# EAGLE design Enclosure 85x58 BHWSL (EAGLE 9.6.2)
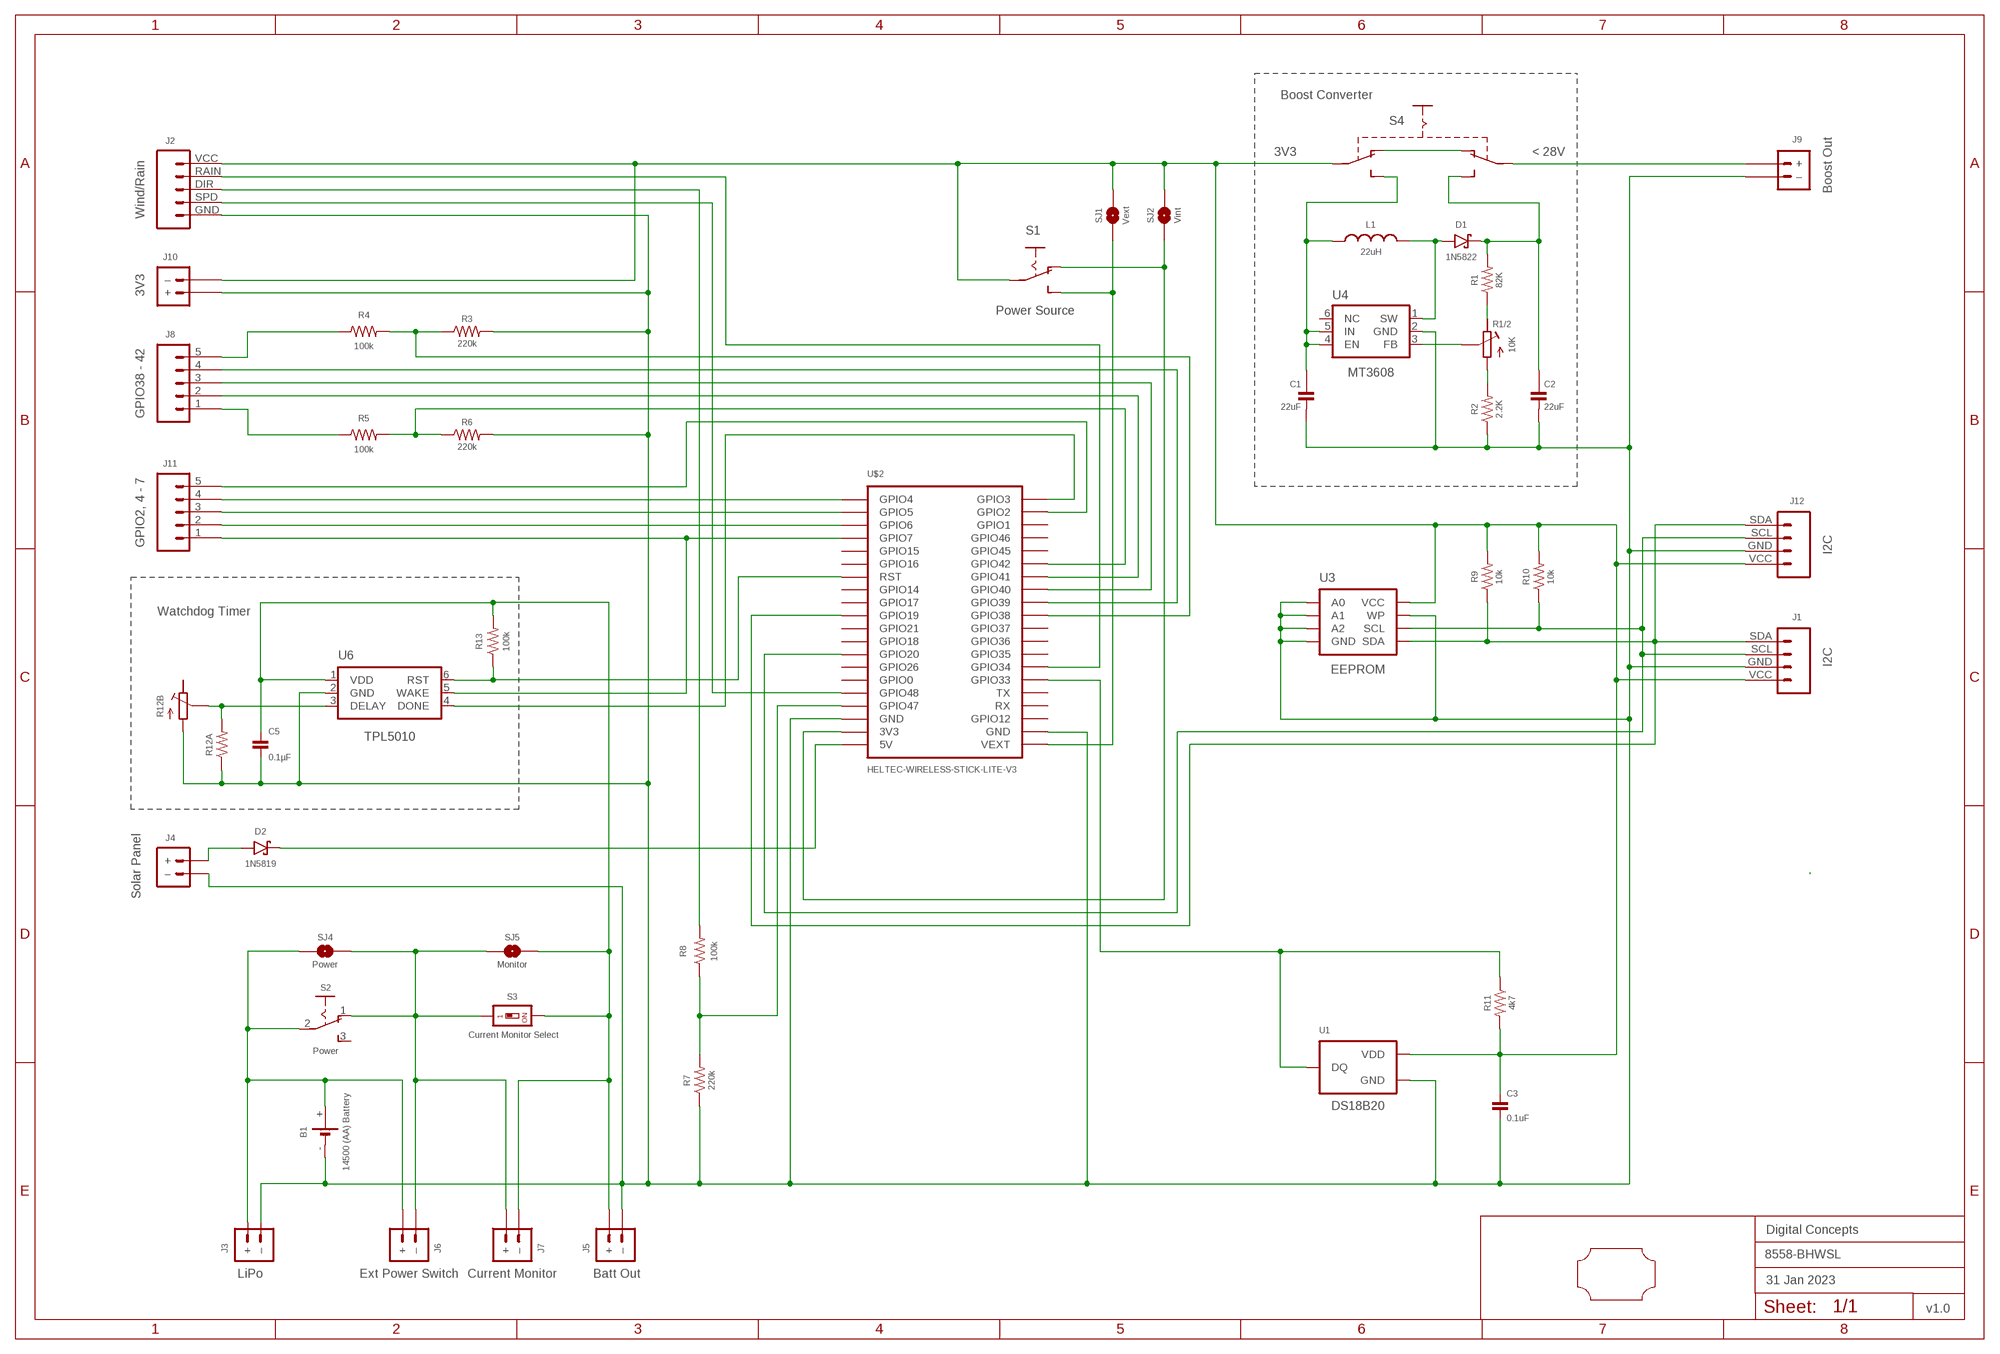
[diagram p0: schematic, sheet 1]
FRAME2 (A3L-LOC): DATE: 31 Jan 2023; OWNER: Digital Concepts; TITLE: 8558-BHWSL; VERSION: v1.0

## Parts
B1  14500 (AA) Battery  BATTERY-HOLDER-14500(AA)  [BATTERY-14500]
C1  22uF  CAPACITOR-1206  [C1206]
C2  22uF  CAPACITOR-1206  [C1206]
C3  0.1uF  CAPACITOR-0805  [C0805]
C5  0.1µF  CAPACITOR-0805  [C0805]
D1  1N5822  DIODE-SCHOTTKY-1N5822  [DIODE_SMB]
D2  1N5819  1N5819-SOD-123  [SOD-123]
J1  I2C  JST-PH2.0-4-VERTICAL-I2C  [JST-PH2.0-4-VERTICAL-I2C]
J2  Wind/Rain  JST-PH2.0-5-VERTICAL-WEATHER  [JST-PH2.0-5-WEATHER]
J3  LiPo  JST-PH2.0-2-MALE-HORIZONTALJST-PTH-2  [JST-PH2.0-2-HORIZONTAL]
J4  Solar Panel  JST-PH2.0-2-DUAL-POWERJST-PTH-2  [JST-PH2.0-2-DUAL-POWER]
J5  Batt Out  JST-GH1.25-2-HORIZONTAL-POWER  [JST-GH1.25-2-HORIZONTAL]
J6  Ext Power Switch  JST-PH2.0-2-DUAL-POWERJST-PTH-2  [JST-PH2.0-2-DUAL-POWER]
J7  Current Monitor  JST-PH2.0-2-HORIZONTAL-POWERJST-PTH-2  [JST-PH2.0-2-HORIZONTAL-POWER@1]
J8  GPIO38 - 42  JST-PH2.0-5-HORIZONTAL  [JST-PH2.0-5-HORIZONTAL]
J9  Boost Out  JST-PH2.0-2-H-POWER  [JST-PH2.0-2-HORIZONTAL-POWER]
J10  3V3  JST-PH2.0-2-H-POWER  [JST-PH2.0-2-HORIZONTAL-POWER]
J11  GPIO2, 4 - 7  JST-PH2.0-5-HORIZONTAL  [JST-PH2.0-5-HORIZONTAL]
J12  I2C  JST-PH2.0-4-HORIZONTAL-I2C  [JST-PH2.0-4-HORIZONTAL-I2C]
L1  22uH  INDUCTOR-CDRH104R/6D28L5038P  [CDRH104R+6D28]
R1  82K  RESISTORR0805  [R0805]
R1/2  10K  RESISTOR-TRIMM-BAOTER-HORIZONTAL  [RTRIM64P]
R2  2.2K  RESISTORR0805  [R0805]
R3  220k  RESISTORR0805  [R0805]
R4  100k  RESISTORR0805  [R0805]
R5  100k  RESISTORR0805  [R0805]
R6  220k  RESISTORR0805  [R0805]
R7  220k  RESISTORR0805  [R0805]
R8  100k  RESISTORR0805  [R0805]
R9  10k  RESISTORR0805  [R0805]
R10  10k  RESISTORR0805  [R0805]
R11  4k7  RESISTORR0805  [R0805]
R12A  RESISTORR0805  [R0805]
R12B  RESISTOR-TRIMM-33  [RTRIM3*3]
R13  100k  RESISTORR0805  [R0805]
S1  Power Source  SWITCH-SLIDE-SPDT-SMT  [SWITCH-SPDT-SMT]
S2  Power  SWITCH-SLIDE-SPDT  [SWITCH-SLIDE-SPDT]
S3  Current Monitor Select  SWITCH-DIP-SWS001  [SMD-001]
S4  SWITCH-SLIDE-DPDT-PTH-S  [SWITCH-DPDT-PTH]
SJ1  Vext  SJ  [SJ]
SJ2  Vint  SJ-V-1  [SJ-VIA-1]
SJ4  Power  SJ  [SJ]
SJ5  Monitor  SJ  [SJ]
U1  DS18B20  THERMOMETER-DS18B20  [TO-92]
U3  EEPROM  AT24CXX-EEPROM  [SOP-8]
U4  MT3608  [SOT-23-6@1]
U6  TPL5010  TPL5010DDCR  [SOT-23-6]
U$1  PCB-OUTLINE-85X58  [PROTO-28X18-OUTLINE]
U$2  HELTEC-WIRELESS-STICK-LITE-V3  [HELTEC-WIRELESS-STICK-LITE-V3]

## Nets
GND: B1.- C1.2 C2.2 C3.2 C5.2 J1.GND J2.GND J3.-(–) J4.-(–) J5.-(–) J9.-(–) J10.+ J12.GND R2.1 R3.2 R6.2 R7.1 R12A.1 R12B.1(A) U1.1(GND) U3.P$1(A0) U3.P$2(A1) U3.P$3(A2) U3.P$4(GND) U3.P$7(WP) U4.2(GND) U6.2(GND) U$2.GND@18(GND) U$2.GND@22(GND)
N$1: D2.A J4.+
N$2: J2.DIR R8.2
N$3: R1.1 R1/2.3(E)
N$4: B1.+ J3.+ J6.+ S2.2(P) SJ4.2
N$5: D2.C U$2.5V
N$6: D1.A L1.1 U4.1(SW)
N$7: R7.2 R8.1 U$2.GPIO47
N$8: J1.SCL J12.SCL R10.1 U3.P$6(SCL) U$2.GPIO20
N$9: J8.1 R5.1
N$10: J11.5 U$2.GPIO2
N$11: J1.SDA J12.SDA R9.1 U3.P$5(SDA) U$2.GPIO19
N$12: J2.SPD U$2.GPIO48
N$13: S1.P$1(O) SJ2.2 U$2.3V3
N$14: C5.1 J5.+ J7.-(–) R13.2 S3.2 SJ5.1 U6.1(VDD)
N$15: J11.4 U$2.GPIO4
N$16: J11.3 U$2.GPIO5
N$18: R11.1 U1.2(DQ) U$2.GPIO33
N$19: J11.2 U$2.GPIO6
N$20: C2.1 D1.C R1.2 S4.P$3(S1)
N$21: S1.P$2(S) SJ1.2 U$2.VEXT
N$22: J2.RAIN U$2.GPIO34
N$23: R1/2.1(A) R2.2
N$24: R1/2.2(S) U4.3(FB)
N$25: C1.1 L1.2 S4.P$6(S2) U4.4(EN) U4.5(IN)
N$26: S4.P$1(O1) S4.P$4(O2)
N$27: J9.+ S4.P$2(P1)
N$28: J11.1 U6.5(WAKE) U$2.GPIO7
N$29: J8.2 U$2.GPIO41
N$30: J8.3 U$2.GPIO40
N$31: J8.4 U$2.GPIO39
N$32: J8.5 R4.1
N$33: R3.1 R4.2 U$2.GPIO38
N$34: R5.2 R6.1 U$2.GPIO42
N$36: R12A.2 R12B.2(S) U6.3(DELAY)
N$37: R13.1 U6.6(RST) U$2.RST
N$38: U6.4(DONE) U$2.GPIO3
N$39: J6.-(–) J7.+ S2.1(O) S3.1 SJ4.1 SJ5.2
VCC: C3.1 J1.VCC J2.VCC J10.-(–) J12.VCC R9.2 R10.2 R11.2 S1.COMMON(P) S4.P$5(P2) SJ1.1 SJ2.1 SJ2.1@V U1.3(VDD) U3.P$8(VCC)
Unconnected: R12B.3(E) S2.3(S) U4.6(NC) U$2.GPIO0 U$2.GPIO1 U$2.GPIO12 U$2.GPIO14 U$2.GPIO15 U$2.GPIO16 U$2.GPIO17 U$2.GPIO18 U$2.GPIO21 U$2.GPIO26 U$2.GPIO35 U$2.GPIO36 U$2.GPIO37 U$2.GPIO45 U$2.GPIO46 U$2.RX U$2.TX

## Notes on the sheet
- Boost Converter
- 3V3 | < 28V
- Watchdog Timer

## Library data of the parts
B1 = digitalconcepts:BATTERY-HOLDER-14500(AA): 14500 (AA) battery holder
C1 C2 = digitalconcepts:CAPACITOR-1206: 1206 Capacitor
C3 C5 = digitalconcepts:CAPACITOR-0805: 0805 Capacitor
D1 = digitalconcepts:DIODE-SCHOTTKY-1N5822: 1N5822 Schottky Diode SMB
D2 = digitalconcepts:1N5819-SOD-123: 1N5819 Schottky Diode SOD-123
J1 = digitalconcepts:JST-PH2.0-4-VERTICAL-I2C: PH2.0 4P I2C Vertical Connector
J2 = digitalconcepts:JST-PH2.0-5-VERTICAL-WEATHER: PH2.0 5P Vertical Weather Connector
J3 = digitalconcepts:JST-PH2.0-2-MALE-HORIZONTAL: PH2.0 2P Right Angle PCB Connector; PROD_ID: CONN-09863; SKU: PRT-09914
J4 J6 = digitalconcepts:JST-PH2.0-2-DUAL-POWER: JST PH2.0 2P PTH Dual-Side Connector (Power); PROD_ID: CONN-09863; SKU: PRT-09914
J5 = digitalconcepts:JST-GH1.25-2-HORIZONTAL-POWER: JST GH1.25 2P PTH Connector (Power)
J7 = digitalconcepts:JST-PH2.0-2-HORIZONTAL-POWER: PH2.0 2P Right Angle PCB Connector; PROD_ID: CONN-09863; SKU: PRT-09914
J8 J11 = digitalconcepts:JST-PH2.0-5-HORIZONTAL: PH2.0 5P Horizontal Connector
J9 J10 = digitalconcepts:JST-PH2.0-2-H-POWER: JST PH2.0 2P Right Angle Connector with power pin labelling
J12 = digitalconcepts:JST-PH2.0-4-HORIZONTAL-I2C: PH2.0 4P I2C Horizontal Connector
L1 = digitalconcepts:INDUCTOR-CDRH104R/6D28: Inductor; SPICEPREFIX: L
R1-R11 R12A R13 = digitalconcepts:RESISTOR: Resistor; SPICEPREFIX: R
R1/2 = digitalconcepts:RESISTOR-TRIMM-BAOTER-HORIZONTAL: Trimm Resistor - Horizontal BAOTER
R12B = digitalconcepts:RESISTOR-TRIMM-3*3: Trimm Resistor - 3*3 SMD
S1 = digitalconcepts:SWITCH-SLIDE-SPDT-SMT: Mini Sliding Switch SPDT SMT
S2 = digitalconcepts:SWITCH-SLIDE-SPDT: Mini Sliding Switch SPDT
S3 = digitalconcepts:SWITCH-DIP-SWS001: SMD Dip Switch 1 pol.
S4 = digitalconcepts:SWITCH-SLIDE-DPDT-PTH-S: Switch DPDT PTH-S
SJ1 SJ4 SJ5 = digitalconcepts:SJ: Solder Jumper
SJ2 = digitalconcepts:SJ-V-1: Solder Jumper with single Pad Via
U1 = digitalconcepts:THERMOMETER-DS18B20: Digital Thermometer -55C-125C TO92-3; AVAILABILITY: Bad; DESCRIPTION: Temperature Sensor Digital, Local -55°C ~ 125°C 12 b 8-uMAX; MF: Maxim Integrated; MP: DS18B20; PACKAGE: TO-92 Maxim Integrated; PRICE: None
U3 = digitalconcepts:AT24CXX-EEPROM: AT24Cxx EEPROM SOP-8
U4 = digitalconcepts:MT3608: MT3608 DC-DC Step-Up Voltage Converter
U6 = digitalconcepts:TPL5010DDCR: TPL5010 Nano-Power System Timer with Watchdog
U$1 = digitalconcepts:PCB-OUTLINE-85X58: PCB outline for 85 x 58 enclosure
U$2 = digitalconcepts:HELTEC-WIRELESS-STICK-LITE-V3: Heltec Wireless Stick Lite V3 MCU

## Board
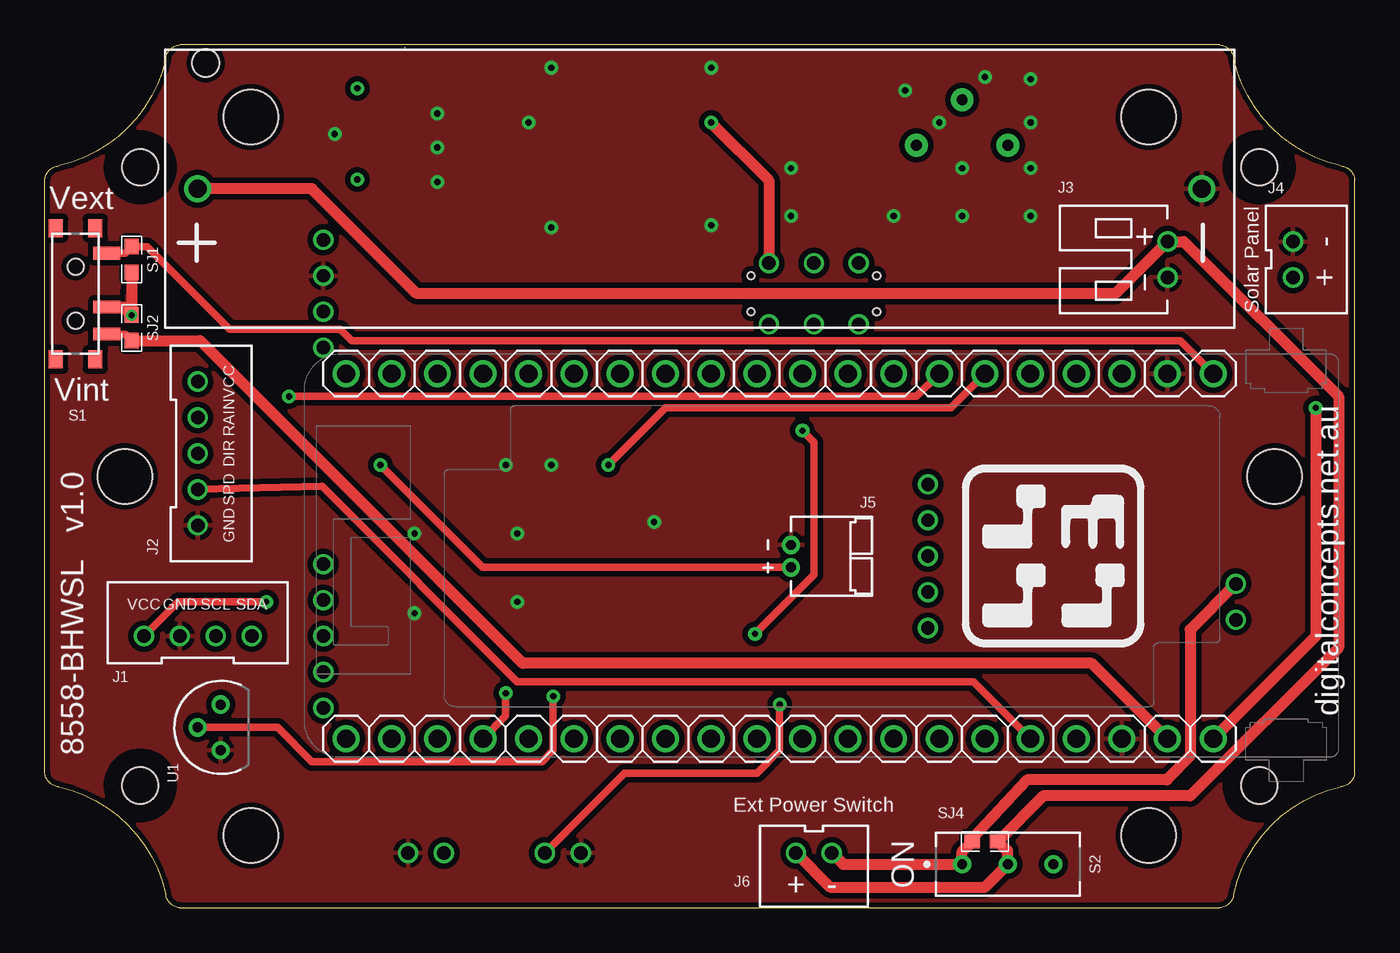
[diagram p1: board, top side]
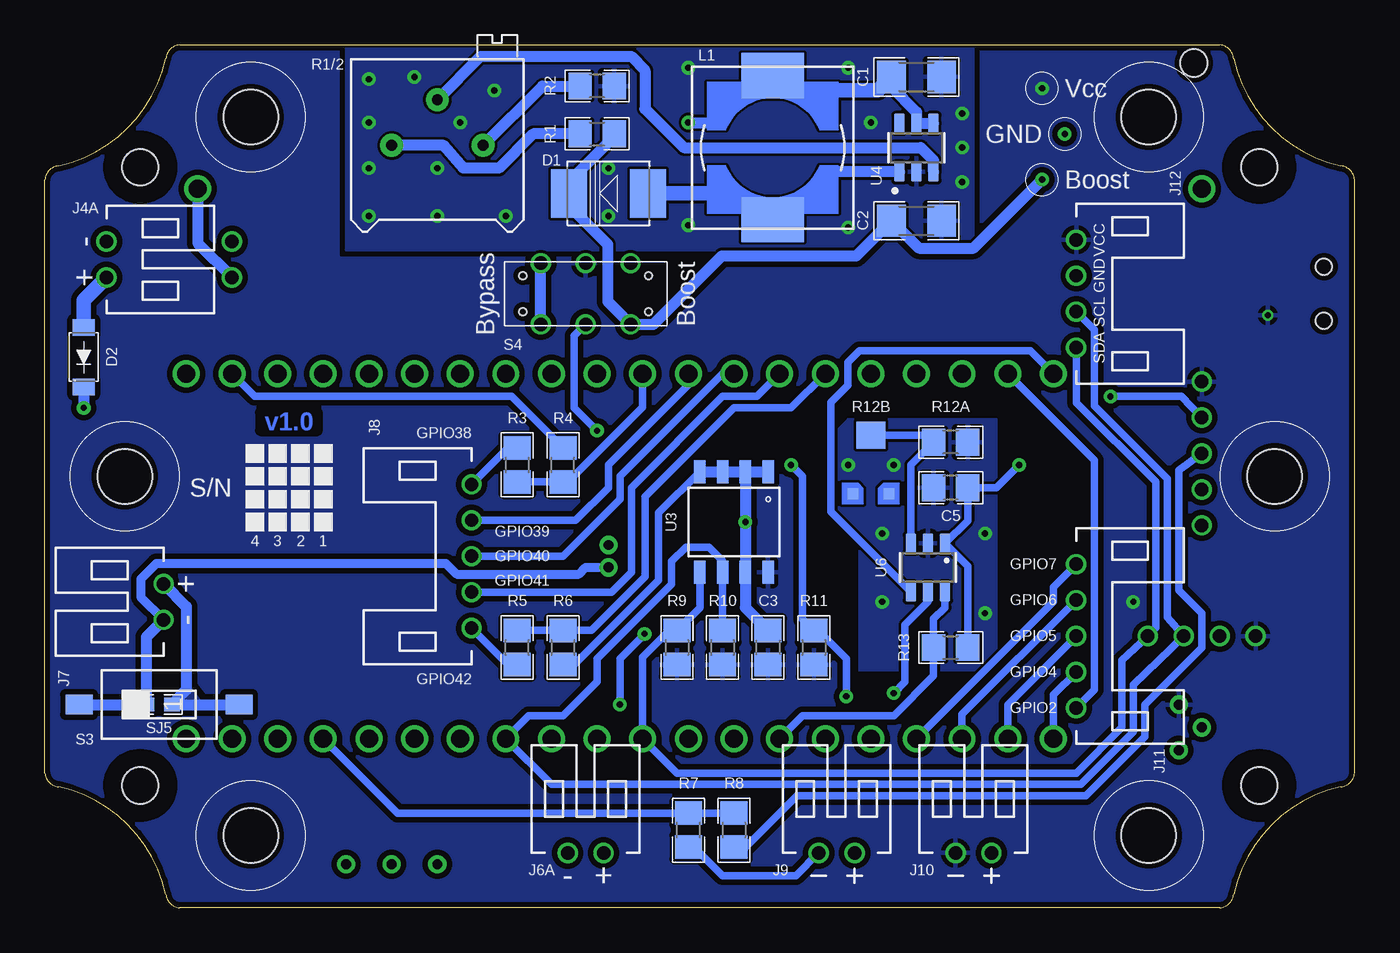
[diagram p2: board, bottom side, seen from below]

Size 72.9 x 48.01 mm. Coordinates in mm from the lower left corner, seen from the top.
Copper layers (1*16): Top 0.035mm / dielectric 1.5mm / Bottom 0.035mm
Design rules "default *": minimum track width 6mil, minimum drill 0.35mm, track to track 6mil, track to pad 6mil, pad to pad 6mil, via to via 6mil, smd to smd 6mil, copper to edge 6mil, drill to drill 6mil, minimum pad ring 1mil, minimum via ring 8mil, stop-mask expansion 4mil, vias tented up to drill 0mil, thermal gap 10mil

### Footprints (pad centres in the part's own frame; a part is rotated, then mirrored left to right if it is on the bottom)
BATTERY-14500 = drill 1: + -27.94,0; - 27.94,0 | hole 1.524: -27.5,7
C1206 = smd 1.6 x 1.8: 1 -1.4,0; 2 1.4,0
C0805 = smd 1.3 x 1.5: 1 -0.95,0; 2 0.95,0
DIODE_SMB = smd 2 x 2.7: A 2.2,0; C -2.2,0
SOD-123 = smd 0.91 x 1.22: A -1.65,0; C 1.65,0
JST-PH2.0-4-VERTICAL-I2C = drill 0.75: GND 1,0; SCL -1,0; SDA -3,0; VCC 3,0
JST-PH2.0-5-WEATHER = drill 0.75: DIR 0,0; GND -4,0; RAIN 2,0; SPD -2,0; VCC 4,0
JST-PH2.0-2-HORIZONTAL = drill 0.75: + 1,0; - -1,0
JST-PH2.0-2-DUAL-POWER = drill 0.75: + 1,0; - -1,0
JST-GH1.25-2-HORIZONTAL = drill 0.55 pad 1.016: + -0.625,0; - 0.625,0
JST-PH2.0-2-HORIZONTAL-POWER@1 = drill 0.75: + 1,0; - -1,0
JST-PH2.0-5-HORIZONTAL = drill 0.75: 1 4,0; 2 2,0; 3 0,0; 4 -2,0; 5 -4,0
JST-PH2.0-2-HORIZONTAL-POWER = drill 0.75: + 1,0; - -1,0
JST-PH2.0-4-HORIZONTAL-I2C = drill 0.75: GND -1,0; SCL 1,0; SDA 3,0; VCC -3,0
CDRH104R+6D28 = smd 2.5 x 3.5: 1 -4,0; 2 4,0
R0805 = smd 1.3 x 1.5: 1 -0.95,0; 2 0.95,0
RTRIM64P = drill 0.61 pad 1.27: 1 0,-2.54; 2 2.54,0; 3 0,2.54
RTRIM3*3 = smd 0.6 x 0.6: 1 -1,-1.6; 3 1,-1.6 | smd 1.6 x 1.5: 2 0,1.65
SWITCH-SPDT-SMT = smd 0.7 x 1.5: COMMON 0.75,1.75; P$1 2.25,1.75; P$2 -2.25,1.75 | smd 1 x 0.8: GND@1 3.65,-1.1; GND@2 3.65,1.1; GND@3 -3.65,1.1; GND@4 -3.65,-1.1 | hole 0.9: -1.5,0; 1.5,0
SWITCH-SLIDE-SPDT = drill 0.55 pad 1.016: 1 -2.54,0; 2 0,0; 3 2.54,0
SMD-001 = smd 1.1 x 1.5: 1 0,-4.45; 2 0,4.45
SWITCH-DPDT-PTH = drill 0.75: P$1 -1.7,2.5; P$2 -1.7,0; P$3 -1.7,-2.5; P$4 1.7,2.5; P$5 1.7,0; P$6 1.7,-2.5 | hole 0.42: 1,3.5; -1,3.5; 1,-3.5; -1,-3.5
SJ = smd 0.864 x 0.762: 1 -0.711,0; 2 0.711,0
SJ-VIA-1 = smd 0.864 x 0.762: 1 -0.711,0; 2 0.711,0 | drill 0.35 pad 0.61: 1@V -0.711,0
TO-92 = drill 0.55 pad 1.016: 1 -1.27,0; 2 0,1.27; 3 1.27,0
SOP-8 = smd 0.635 x 1.27: P$1 -1.905,-2.794; P$2 -0.635,-2.794; P$3 0.635,-2.794; P$4 1.905,-2.794; P$5 1.905,2.794; P$6 0.635,2.794; P$7 -0.635,2.794; P$8 -1.905,2.794
SOT-23-6@1 = smd 1.1 x 0.6: 1 -1.35,0.95; 2 -1.35,0; 3 -1.35,-0.95; 4 1.35,-0.95; 5 1.35,0; 6 1.35,0.95
SOT-23-6 = smd 1.1 x 0.6: 1 -1.35,0.95; 2 -1.35,0; 3 -1.35,-0.95; 4 1.35,-0.95; 5 1.35,0; 6 1.35,0.95
PROTO-28X18-OUTLINE = hole 2.032: -31.14,17.196; -31.14,-17.196; 31.14,-17.196; 31.14,17.196 | hole 3.048: -24.994,19.99; -32.004,0; -24.994,-19.99; 24.994,-19.99; 32.004,0; 24.994,19.99
HELTEC-WIRELESS-STICK-LITE-V3 = drill 1: 3V3 0,45.72; 5V 0,48.26; GND@18 0,43.18; GND@22 -20.32,45.72; GPIO0 0,35.56; GPIO1 -20.32,5.08; GPIO2 -20.32,2.54; GPIO3 -20.32,0; GPIO4 0,0; GPIO5 0,2.54; GPIO6 0,5.08; GPIO7 0,7.62; GPIO12 -20.32,43.18; GPIO14 0,17.78; GPIO15 0,10.16; GPIO16 0,12.7; GPIO17 0,20.32; GPIO18 0,27.94; GPIO19 0,22.86; GPIO20 0,30.48; GPIO21 0,25.4; GPIO26 0,33.02; GPIO33 -20.32,35.56; GPIO34 -20.32,33.02; GPIO35 -20.32,30.48; GPIO36 -20.32,27.94; GPIO37 -20.32,25.4; GPIO38 -20.32,22.86; GPIO39 -20.32,20.32; GPIO40 -20.32,17.78; GPIO41 -20.32,15.24; GPIO42 -20.32,12.7; GPIO45 -20.32,10.16; GPIO46 -20.32,7.62; GPIO47 0,40.64; GPIO48 0,38.1; RST 0,15.24; RX -20.32,40.64; TX -20.32,38.1; VEXT -20.32,48.26

### Placement (x,y rotation side)
B1  36.45,40.01 0 top
C1  24.38,46.23 0 bottom
C2  24.38,38.23 0 bottom
C3  32.64,14.48 90 bottom
C5  22.48,23.37 180 bottom
D1  41.53,39.75 0 bottom
D2  70.74,30.63 270 bottom
J1  8.51,15.11 180 top
J2  8.51,25.27 90 top
J3  62.48,36.07 90 top
J4  69.47,36.07 270 bottom
J5  41.53,19.56 90 top
J6  42.8,3.05 0 bottom
J7  66.29,17.02 90 bottom
J8  49.15,19.56 270 bottom
J9  28.83,3.05 0 bottom
J10  21.21,3.05 0 bottom
J11  15.49,15.11 90 bottom
J12  15.49,34.16 270 bottom
L1  32.38,42.29 90 bottom
R1  42.16,43.05 0 bottom
R1/2  51.05,42.42 90 bottom
R2  42.16,45.72 180 bottom
R3  44.07,24.64 90 bottom
R4  46.61,24.64 270 bottom
R5  46.61,14.48 90 bottom
R6  44.07,14.48 270 bottom
R7  37.08,4.32 90 bottom
R8  34.54,4.32 270 bottom
R9  37.72,14.48 270 bottom
R10  35.18,14.48 270 bottom
R11  30.1,14.48 270 bottom
R12A  22.48,25.91 180 bottom
R12B  26.92,24.64 0 bottom
R13  22.48,14.48 0 bottom
S1  1.7,34.16 270 top
S2  53.59,2.41 0 top
S3  66.55,11.3 90 bottom
S4  42.8,34.16 90 bottom
SJ1  4.83,36.07 90 top
SJ2  4.83,32.26 270 top
SJ4  52.32,3.68 0 top
SJ5  66.55,11.3 0 bottom
U1  9.78,10.03 90 top
U3  34.54,21.46 180 bottom
U4  24.38,42.29 90 bottom
U6  23.75,18.92 270 bottom
U$1  36.45,24 0 top
U$2  16.76,9.4 270 top

### Tracks (layer width: path | path; a pad name or v marks a point on that pad's centre or on a via)
$X1
  cutout Bottom: 67.59,43.23 arc180 67.59,39.17 arc180
$X2
  cutout Bottom: 67.59,8.84 arc180 67.59,4.78 arc180
$X3
  cutout Bottom: 5.31,8.84 arc180 5.31,4.78 arc180
$X4
  cutout Bottom: 5.31,43.23 arc180 5.31,39.17 arc180
$X5
  cutout Top: 5.31,43.23 arc180 5.31,39.17 arc180
$X6
  cutout Top: 67.59,43.23 arc180 67.59,39.17 arc180
$X7
  cutout Top: 67.59,8.84 arc180 67.59,4.78 arc180
$X8
  cutout Top: 5.31,8.84 arc180 5.31,4.78 arc180
GND  (via drill 0.35)
  Bottom 0.406: J9.- 31.1,1.78 35.18,1.78 36.77,3.37 R7.1 | U$2.GND@22 61.21,28.45 46.93,28.45 R3.2 | R6.2 43.43,13.53 38.73,18.23 38.73,21.97 U3.P$4
  Bottom 0.61: U3.P$4 U3.P$3 U3.P$2 | U3.P$2 U3.P$1 | B1.- 64.39,36.97 J3.- | C3.2 33.91,16.7 U3.P$7 v33.91,21.46 U3.P$2
  other vias: 21.84,44.2 26.92,43.69 37.08,37.97 37.08,46.74 47.88,45.47 52.32,46.23 41.53,38.48 47.24,38.48 51.05,38.48 51.05,41.15 54.86,38.48 54.86,41.15 54.86,46.1 21.84,40.39 49.78,43.69 54.86,43.69 28.19,37.85 41.53,41.15 16.13,43.05 21.84,42.29 28.19,46.74 28.19,24.64 25.65,24.64 20.57,20.83 20.57,16.38 26.29,20.83 26.29,17.02
  pour Top (isolate 0.305, rank 2): -2.08,49.93 -2.08,-1.97 74.92,-1.97 74.92,49.93
  pour Bottom (rank 2): 21.21,48.13 21.21,36.58 56.13,36.58 56.13,48.13
  pour Bottom: 27.56,13.21 19.94,13.21 19.94,27.18 28.19,27.18 28.83,26.54 28.83,26.54 28.83,22.1 27.56,20.83
N$1
  Bottom 0.813: D2.A 70.74,33.8 J4.+
N$2
  Bottom 0.406: R8.2 33.91,3.37 31.04,6.24 14.97,6.24 11.68,9.53 11.68,11.3 8.51,14.48 8.51,16.38 9.78,17.65 9.78,24.33 J2.DIR
N$3
  Bottom 0.61: R1.1 45.72,43.05 47.62,41.15 49.6,41.15 50.69,42.42 R1/2.3
N$4
  Top 0.61: B1.+ 14.86,40.01 20.7,34.16 59.58,34.16 J3.+ 63.39,37.07 72.01,28.45 72.01,14.48 63.75,6.22 55.58,6.22 SJ4.2 53.52,3.19 53.59,3.18 S2.2 52.32,1.14 43.7,1.14 J6.+
N$5  (via drill 0.35)
  Top 0.61: U$2.5V 70.74,15.11 v70.74,27.81
  Bottom 0.61: D2.C v70.74,27.81
N$6
  Bottom 0.61: L1.1 31.75,38.29 29.1,40.94 U4.1
  Bottom 0.813: D1.A 34.54,39.75 33.08,38.29 L1.1
N$7
  Bottom 0.406: R8.1 R7.2 53.27,5.27 U$2.GPIO47
N$8
  Bottom 0.406: J12.SCL 14.48,32.15 14.48,27.94 10.41,23.88 10.41,16.16 J1.SCL 12.32,12.41 12.32,9.78 15.24,6.86 44.7,6.86 U$2.GPIO20 45.97,10.67 44.07,10.67 42.16,12.57 42.16,13.84 38.01,18 38.01,19.27 37.21,20.07 35.94,20.07 35.18,19.3 U3.P$6 R10.1
N$9
  Bottom 0.406: J8.1 47.12,13.53 R5.1
N$10
  Bottom 0.406: J11.5 14.48,12.13 14.48,24.89 U$2.GPIO2
N$11
  Bottom 0.406: J12.SDA 15.49,28.1 11.05,23.7 11.05,15.57 J1.SDA 12.95,13.78 12.95,10.03 15.49,7.49 37.72,7.49 U$2.GPIO19 39.62,13.93 38.12,15.43 R9.1 36.45,16.7 U3.P$5
N$12
  Top 0.406: J2.SPD 15.42,23.44 26.29,12.57 51.69,12.57 U$2.GPIO48
N$13
  Top 0.406: SJ2.2 4.46,31.91 S1.P$1
  Top 0.61: SJ2.2 8.64,31.55 26.59,13.59 58.28,13.59 U$2.3V3
N$14  (via drill 0.35)
  Top 0.406: J5.+ 24.37,18.93 v18.67,24.64
  Bottom 0.406: R13.2 21.53,19 U6.1 21.53,21.54 C5.1 19.94,23.37 v18.67,24.64
  Bottom 0.508: J7.- 67.56,17.29 67.56,18.29 66.69,19.16 50.59,19.16 49.98,18.56 43.17,18.56 42.8,18.93 J5.+
  Bottom 0.61: S3.2 SJ5.1 67.26,15.05 J7.-
N$15
  Bottom 0.406: J11.4 16.76,11.84 U$2.GPIO4
N$16
  Bottom 0.406: J11.3 19.3,11.3 U$2.GPIO5
N$18  (via drill 0.35)
  Top 0.406: U$2.GPIO33 50.42,27.81 34.54,27.81 v31.37,24.64 | v28.29,11.76 28.29,8.76 27.66,8.13 14.86,8.13 12.95,10.03 U1.2
  Bottom 0.406: v31.37,24.64 30.73,24 30.73,16.06 R11.1 29.88,15.43 28.29,13.84 v28.29,11.76
N$19
  Bottom 0.406: J11.2 21.84,10.76 U$2.GPIO6
N$20  (via drill 0.35)
  Bottom 0.61: v17.4,40.51 21.21,36.7 24.26,36.7 C2.1 27.74,36.27 35.22,36.27 39.03,32.46 S4.P$3 41.57,33.73 41.57,36.91 43.73,39.07 D1.C 43.73,40.39 41.21,42.91 R1.2
N$21
  Top 0.406: S1.P$2 4.46,36.41 SJ1.2 5.7,36.78 10.29,32.18 16.42,32.18 17.06,31.55 63.2,31.55 U$2.VEXT
N$22  (via drill 0.35)
  Top 0.406: U$2.GPIO34 48.51,28.45 v13.59,28.45
  Bottom 0.406: J2.RAIN 9.65,28.45 v13.59,28.45
N$23
  Bottom 0.61: R1/2.1 45.21,45.72 R2.2
N$24
  Bottom 0.61: R1/2.2 48.64,47.37 40.26,47.37 39.5,46.61 39.5,44.45 37.34,42.29 24.15,42.29 23.43,41.58 U4.3
N$25  (via drill 0.35)
  Top 0.61: v37.08,43.69 40.3,40.47 S4.P$6
  Bottom 0.61: C1.1 25.78,45.67 24.38,44.27 U4.5 U4.4 | v37.08,43.69 35.81,43.69 33.21,46.29 L1.2
  Bottom 0.813: C1.1 26.53,45.48 31.58,45.48 L1.2
N$26
  Bottom 0.61: S4.P$1 S4.P$4
N$27  (via drill 0.35)
  Top 0.406: J9.+ 32.27,7.49 39.62,7.49 40.89,8.76 v40.89,11.3 | v42.16,26.54 42.8,25.91 42.8,18.52 v39.52,15.24
  Bottom 0.406: v40.89,11.3 40.89,13.84 39.52,15.22 v39.52,15.24 | v42.16,26.54 43.43,27.81 43.43,31.83 S4.P$2
N$28  (via drill 0.35)
  Top 0.406: v25.65,11.94 25.65,10.67 U$2.GPIO7
  Bottom 0.406: J11.1 16.76,17.84 16.76,17.02 U$2.GPIO7 | U6.5 23.75,17.02 25.02,15.75 25.02,12.57 v25.65,11.94
N$29
  Bottom 0.406: J8.2 41.37,17.56 40.26,18.67 40.26,23.37 35.18,28.45 33.27,28.45 U$2.GPIO41
N$30
  Bottom 0.406: J8.3 44.07,19.56 40.89,22.73 40.89,24 35.18,29.72 U$2.GPIO40
N$31
  Bottom 0.406: U$2.GPIO39 37.08,29.11 41.53,24.64 41.53,23.37 43.36,21.56 J8.4
N$32
  Bottom 0.406: J8.5 47.12,25.59 R4.1
N$33
  Bottom 0.406: U$2.GPIO38 39.62,27.85 43.79,23.69 R3.1 R4.2
N$34
  Bottom 0.406: U$2.GPIO42 31.37,27.81 34.54,27.81 39.5,22.86 39.5,18.41 42.48,15.43 R6.1 R5.2
N$36
  Bottom 0.406: R12B.2 23.81,26.29 R12A.2 24.7,24.64 U6.3
N$37
  Bottom 0.406: U6.6 22.8,16.7 23.43,16.07 R13.1 23.43,12.89 25.65,10.67 30.73,10.67 U$2.RST
N$38
  Bottom 0.406: U$2.GPIO3 18.03,30.99 27.56,30.99 28.19,30.35 28.19,29.08 29.14,28.13 29.14,22.02 U6.4
N$39
  Top 0.61: J7.+ 63.75,15.48 63.75,8.46 62.46,7.11 54.66,7.11 51.61,3.87 SJ4.1 51.05,3.12 S2.1 44.43,2.41 J6.-
  Bottom 0.61: J7.+ 65.02,16.75 65.02,12.12 SJ5.2 S3.1
  pour Bottom: 65.85,11.3 65.02,12.12 64.39,11.3
VCC  (via drill 0.35)
  Top 0.406: J1.VCC 7.41,17.02 v12.32,17.02
  Top 0.61: S1.COMMON 4.38,33.41 SJ2.1@V SJ1.1
  other vias: 17.4,45.59
  pour Bottom (isolate 0.305, rank 5): -1.08,48.93 -1.08,-0.97 73.92,-0.97 73.92,48.93
  pour Top: 4.22,33.46 4.7,33.93 4.7,32.98

### Text on the board
Bottom: v1.0
tPlace: digitalconcepts.net.au | 8558-BHWSL v1.0
bPlace: S/N | 1 | 2 | 3 | 4
tNames: Vext | Solar Panel | Vint | ON
bNames: Vcc | GND | Boost | J4A | Boost | Bypass | GPIO38 | GPIO39 | GPIO40 | GPIO7 | GPIO41 | GPIO6 | GPIO5 | GPIO4 | GPIO42 | GPIO2 | J6A